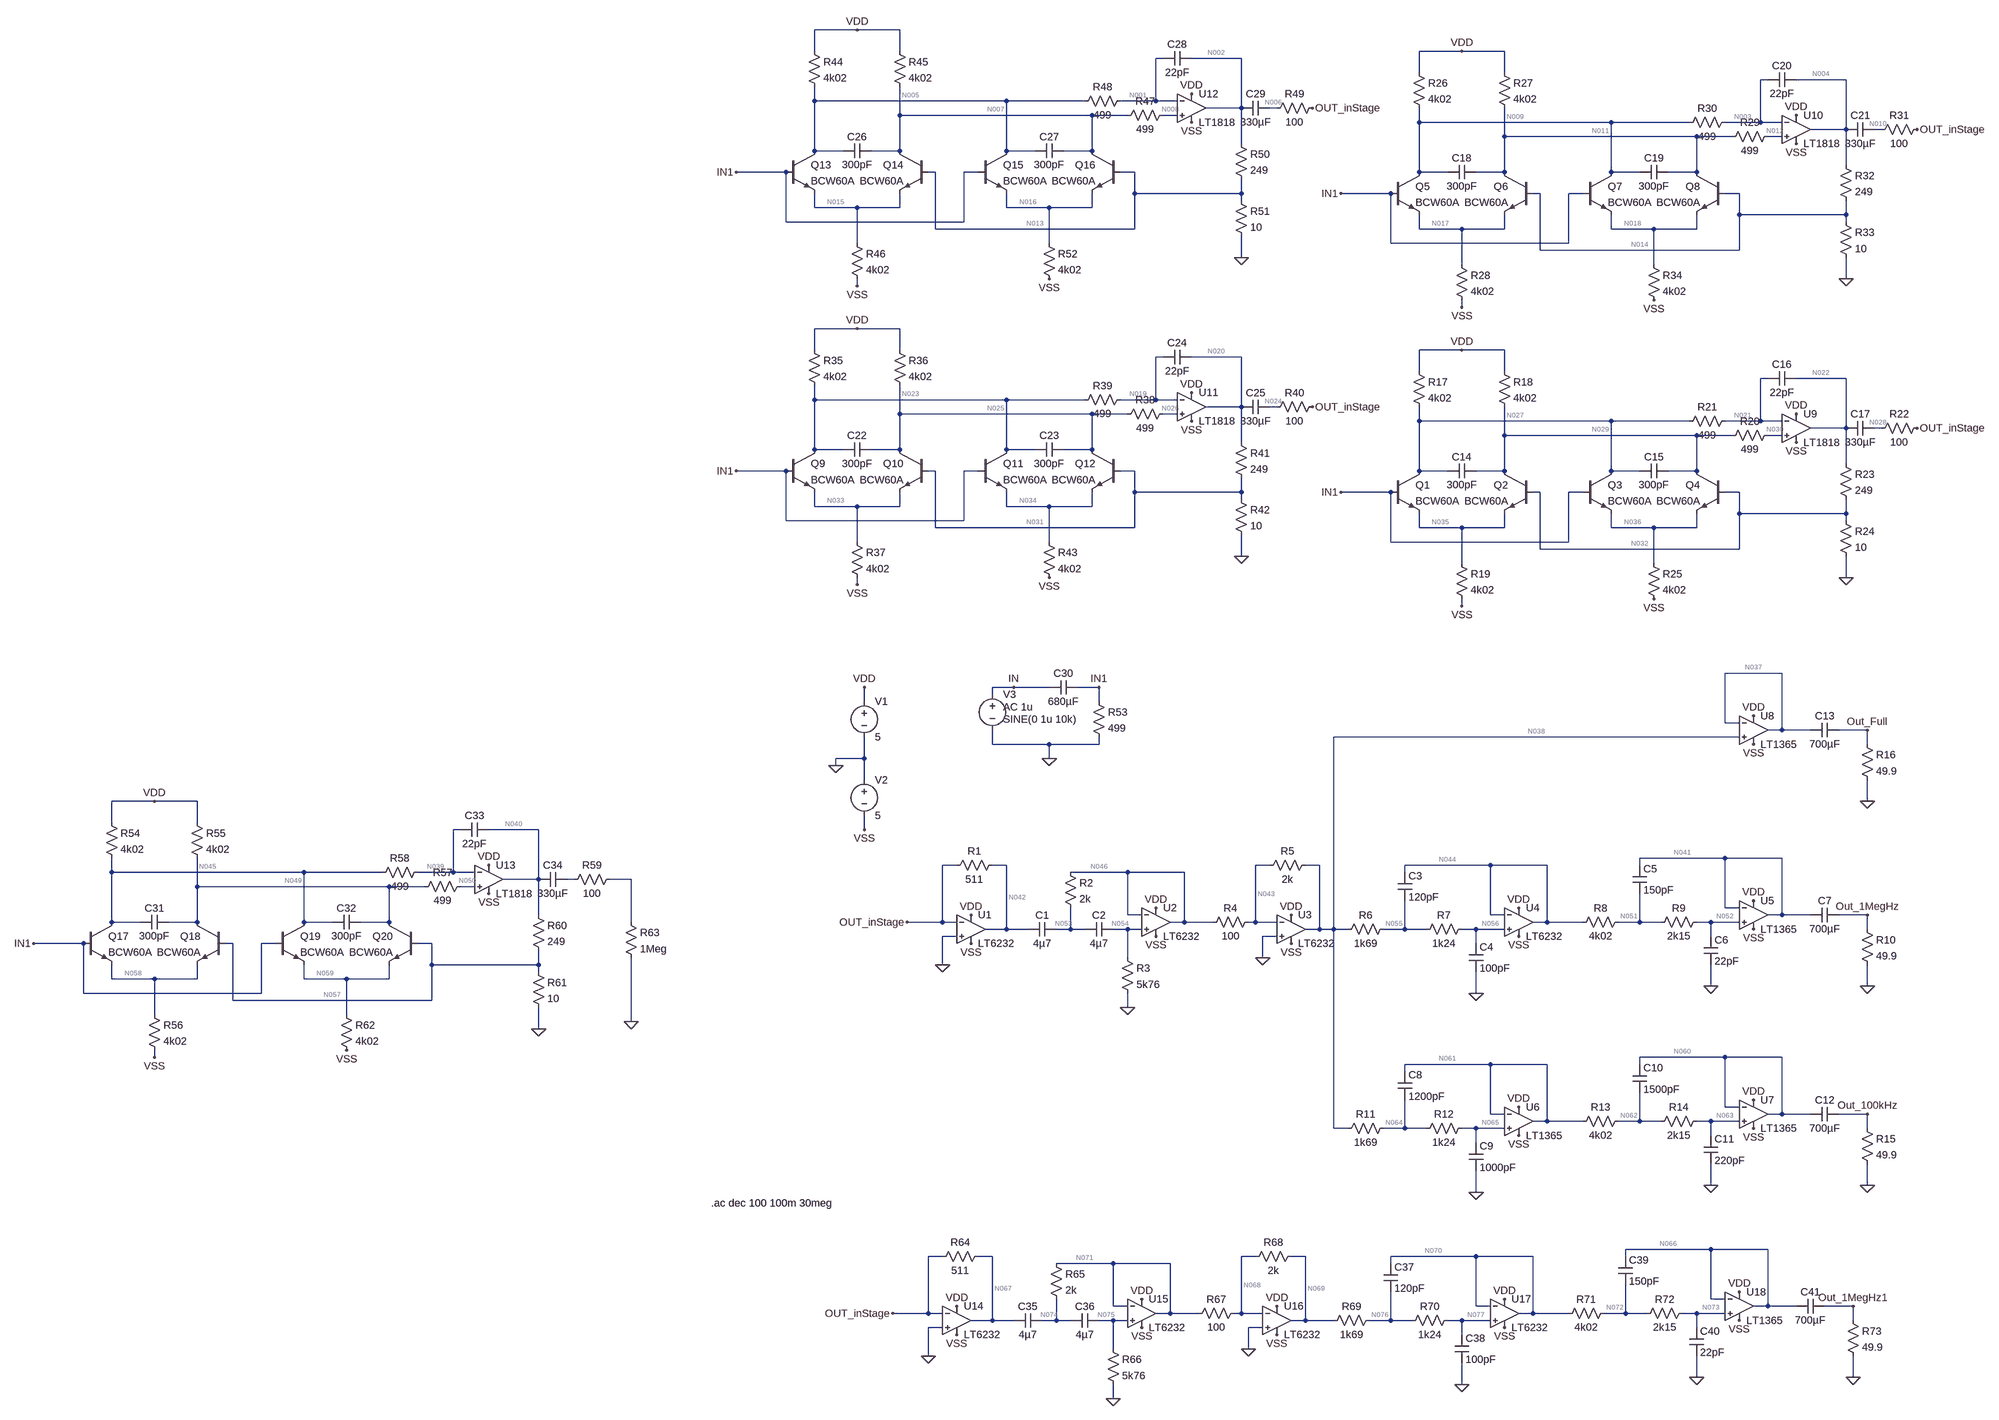
[diagram p0: schematic LNA_1MHz.asc]
LNA_1MHz.asc, the LTspice schematic file:
Version 4
SHEET 1 2840 1804
WIRE -64 -1680 -160 -1680
WIRE 32 -1680 -64 -1680
WIRE -160 -1632 -160 -1680
WIRE 32 -1632 32 -1680
WIRE 1296 -1632 1200 -1632
WIRE 1392 -1632 1296 -1632
WIRE 624 -1616 608 -1616
WIRE 800 -1616 688 -1616
WIRE 1200 -1584 1200 -1632
WIRE 1392 -1584 1392 -1632
WIRE 1984 -1568 1968 -1568
WIRE 2160 -1568 2048 -1568
WIRE -160 -1520 -160 -1552
WIRE 272 -1520 -160 -1520
WIRE 448 -1520 272 -1520
WIRE 608 -1520 608 -1616
WIRE 608 -1520 528 -1520
WIRE 656 -1520 608 -1520
WIRE 800 -1504 800 -1616
WIRE 800 -1504 720 -1504
WIRE 880 -1504 864 -1504
WIRE 32 -1488 32 -1552
WIRE 464 -1488 32 -1488
WIRE 544 -1488 464 -1488
WIRE 656 -1488 624 -1488
WIRE 1200 -1472 1200 -1504
WIRE 1632 -1472 1200 -1472
WIRE 1808 -1472 1632 -1472
WIRE 1968 -1472 1968 -1568
WIRE 1968 -1472 1888 -1472
WIRE 2016 -1472 1968 -1472
WIRE 2160 -1456 2160 -1568
WIRE 2160 -1456 2080 -1456
WIRE 2240 -1456 2224 -1456
WIRE 1392 -1440 1392 -1504
WIRE 1824 -1440 1392 -1440
WIRE 1904 -1440 1824 -1440
WIRE 2016 -1440 1984 -1440
WIRE 800 -1424 800 -1504
WIRE -160 -1408 -160 -1520
WIRE -96 -1408 -160 -1408
WIRE 32 -1408 32 -1488
WIRE 32 -1408 -32 -1408
WIRE 272 -1408 272 -1520
WIRE 336 -1408 272 -1408
WIRE 464 -1408 464 -1488
WIRE 464 -1408 400 -1408
WIRE 2160 -1376 2160 -1456
WIRE -224 -1360 -336 -1360
WIRE 112 -1360 96 -1360
WIRE 208 -1360 176 -1360
WIRE 560 -1360 528 -1360
WIRE 1200 -1360 1200 -1472
WIRE 1264 -1360 1200 -1360
WIRE 1392 -1360 1392 -1440
WIRE 1392 -1360 1328 -1360
WIRE 1632 -1360 1632 -1472
WIRE 1696 -1360 1632 -1360
WIRE 1824 -1360 1824 -1440
WIRE 1824 -1360 1760 -1360
WIRE 560 -1312 560 -1360
WIRE 800 -1312 800 -1344
WIRE 800 -1312 560 -1312
WIRE 1136 -1312 1024 -1312
WIRE 1472 -1312 1456 -1312
WIRE 1568 -1312 1536 -1312
WIRE 1920 -1312 1888 -1312
WIRE 800 -1296 800 -1312
WIRE -160 -1280 -160 -1312
WIRE -64 -1280 -160 -1280
WIRE 32 -1280 32 -1312
WIRE 32 -1280 -64 -1280
WIRE 272 -1280 272 -1312
WIRE 368 -1280 272 -1280
WIRE 464 -1280 464 -1312
WIRE 464 -1280 368 -1280
WIRE 1920 -1264 1920 -1312
WIRE 2160 -1264 2160 -1296
WIRE 2160 -1264 1920 -1264
WIRE -224 -1248 -224 -1360
WIRE 176 -1248 176 -1360
WIRE 176 -1248 -224 -1248
WIRE 2160 -1248 2160 -1264
WIRE 112 -1232 112 -1360
WIRE 560 -1232 560 -1312
WIRE 560 -1232 112 -1232
WIRE 1200 -1232 1200 -1264
WIRE 1296 -1232 1200 -1232
WIRE 1392 -1232 1392 -1264
WIRE 1392 -1232 1296 -1232
WIRE 1632 -1232 1632 -1264
WIRE 1728 -1232 1632 -1232
WIRE 1824 -1232 1824 -1264
WIRE 1824 -1232 1728 -1232
WIRE -64 -1200 -64 -1280
WIRE 368 -1200 368 -1280
WIRE 1136 -1200 1136 -1312
WIRE 1536 -1200 1536 -1312
WIRE 1536 -1200 1136 -1200
WIRE 1472 -1184 1472 -1312
WIRE 1920 -1184 1920 -1264
WIRE 1920 -1184 1472 -1184
WIRE 800 -1168 800 -1216
WIRE 1296 -1152 1296 -1232
WIRE 1728 -1152 1728 -1232
WIRE 2160 -1120 2160 -1168
WIRE -64 -1104 -64 -1120
WIRE 1296 -1056 1296 -1072
WIRE -64 -1008 -160 -1008
WIRE 32 -1008 -64 -1008
WIRE -160 -960 -160 -1008
WIRE 32 -960 32 -1008
WIRE 1296 -960 1200 -960
WIRE 1392 -960 1296 -960
WIRE 624 -944 608 -944
WIRE 800 -944 688 -944
WIRE 1200 -912 1200 -960
WIRE 1392 -912 1392 -960
WIRE 1984 -896 1968 -896
WIRE 2160 -896 2048 -896
WIRE -160 -848 -160 -880
WIRE 272 -848 -160 -848
WIRE 448 -848 272 -848
WIRE 608 -848 608 -944
WIRE 608 -848 528 -848
WIRE 656 -848 608 -848
WIRE 800 -832 800 -944
WIRE 800 -832 720 -832
WIRE 880 -832 864 -832
WIRE 32 -816 32 -880
WIRE 464 -816 32 -816
WIRE 544 -816 464 -816
WIRE 656 -816 624 -816
WIRE 1200 -800 1200 -832
WIRE 1632 -800 1200 -800
WIRE 1808 -800 1632 -800
WIRE 1968 -800 1968 -896
WIRE 1968 -800 1888 -800
WIRE 2016 -800 1968 -800
WIRE 2160 -784 2160 -896
WIRE 2160 -784 2080 -784
WIRE 2240 -784 2224 -784
WIRE 1392 -768 1392 -832
WIRE 1824 -768 1392 -768
WIRE 1904 -768 1824 -768
WIRE 2016 -768 1984 -768
WIRE 800 -752 800 -832
WIRE -160 -736 -160 -848
WIRE -96 -736 -160 -736
WIRE 32 -736 32 -816
WIRE 32 -736 -32 -736
WIRE 272 -736 272 -848
WIRE 336 -736 272 -736
WIRE 464 -736 464 -816
WIRE 464 -736 400 -736
WIRE 2160 -704 2160 -784
WIRE -224 -688 -336 -688
WIRE 112 -688 96 -688
WIRE 208 -688 176 -688
WIRE 560 -688 528 -688
WIRE 1200 -688 1200 -800
WIRE 1264 -688 1200 -688
WIRE 1392 -688 1392 -768
WIRE 1392 -688 1328 -688
WIRE 1632 -688 1632 -800
WIRE 1696 -688 1632 -688
WIRE 1824 -688 1824 -768
WIRE 1824 -688 1760 -688
WIRE 560 -640 560 -688
WIRE 800 -640 800 -672
WIRE 800 -640 560 -640
WIRE 1136 -640 1024 -640
WIRE 1472 -640 1456 -640
WIRE 1568 -640 1536 -640
WIRE 1920 -640 1888 -640
WIRE 800 -624 800 -640
WIRE -160 -608 -160 -640
WIRE -64 -608 -160 -608
WIRE 32 -608 32 -640
WIRE 32 -608 -64 -608
WIRE 272 -608 272 -640
WIRE 368 -608 272 -608
WIRE 464 -608 464 -640
WIRE 464 -608 368 -608
WIRE 1920 -592 1920 -640
WIRE 2160 -592 2160 -624
WIRE 2160 -592 1920 -592
WIRE -224 -576 -224 -688
WIRE 176 -576 176 -688
WIRE 176 -576 -224 -576
WIRE 2160 -576 2160 -592
WIRE 112 -560 112 -688
WIRE 560 -560 560 -640
WIRE 560 -560 112 -560
WIRE 1200 -560 1200 -592
WIRE 1296 -560 1200 -560
WIRE 1392 -560 1392 -592
WIRE 1392 -560 1296 -560
WIRE 1632 -560 1632 -592
WIRE 1728 -560 1632 -560
WIRE 1824 -560 1824 -592
WIRE 1824 -560 1728 -560
WIRE -64 -528 -64 -608
WIRE 368 -528 368 -608
WIRE 1136 -528 1136 -640
WIRE 1536 -528 1536 -640
WIRE 1536 -528 1136 -528
WIRE 1472 -512 1472 -640
WIRE 1920 -512 1920 -592
WIRE 1920 -512 1472 -512
WIRE 800 -496 800 -544
WIRE 1296 -480 1296 -560
WIRE 1728 -480 1728 -560
WIRE 2160 -448 2160 -496
WIRE -64 -432 -64 -448
WIRE 1296 -384 1296 -400
WIRE 2016 -208 1888 -208
WIRE 288 -176 240 -176
WIRE 368 -176 288 -176
WIRE 480 -176 432 -176
WIRE 240 -160 240 -176
WIRE -48 -144 -48 -176
WIRE 480 -144 480 -176
WIRE 1888 -96 1888 -208
WIRE 1920 -96 1888 -96
WIRE 2016 -80 2016 -208
WIRE 2016 -80 1984 -80
WIRE 2080 -80 2016 -80
WIRE 2208 -80 2144 -80
WIRE 1920 -64 1008 -64
WIRE 240 -48 240 -80
WIRE 368 -48 240 -48
WIRE 480 -48 480 -64
WIRE 480 -48 368 -48
WIRE 2208 -48 2208 -80
WIRE -48 -16 -48 -64
WIRE -48 -16 -112 -16
WIRE 368 -16 368 -48
WIRE -112 0 -112 -16
WIRE -48 32 -48 -16
WIRE -1696 80 -1792 80
WIRE -1600 80 -1696 80
WIRE 2208 80 2208 32
WIRE -1792 128 -1792 80
WIRE -1600 128 -1600 80
WIRE -1008 144 -1024 144
WIRE -832 144 -944 144
WIRE -48 144 -48 112
WIRE 1888 208 1696 208
WIRE 2016 208 1888 208
WIRE 160 224 128 224
WIRE 272 224 240 224
WIRE 864 224 832 224
WIRE 976 224 944 224
WIRE 1360 224 1168 224
WIRE 1488 224 1360 224
WIRE 1696 224 1696 208
WIRE -1792 240 -1792 208
WIRE -1360 240 -1792 240
WIRE -1184 240 -1360 240
WIRE -1024 240 -1024 144
WIRE -1024 240 -1104 240
WIRE -976 240 -1024 240
WIRE 544 240 416 240
WIRE 672 240 544 240
WIRE 1168 240 1168 224
WIRE -832 256 -832 144
WIRE -832 256 -912 256
WIRE -752 256 -768 256
WIRE -624 256 -672 256
WIRE -1600 272 -1600 208
WIRE -1168 272 -1600 272
WIRE -1088 272 -1168 272
WIRE -976 272 -1008 272
WIRE 1888 320 1888 208
WIRE 1920 320 1888 320
WIRE -832 336 -832 256
WIRE 544 336 544 240
WIRE 576 336 544 336
WIRE 1360 336 1360 224
WIRE 1392 336 1360 336
WIRE 2016 336 2016 208
WIRE 2016 336 1984 336
WIRE 2080 336 2016 336
WIRE 2208 336 2144 336
WIRE -1792 352 -1792 240
WIRE -1728 352 -1792 352
WIRE -1600 352 -1600 272
WIRE -1600 352 -1664 352
WIRE -1360 352 -1360 240
WIRE -1296 352 -1360 352
WIRE -1168 352 -1168 272
WIRE -1168 352 -1232 352
WIRE -624 352 -624 256
WIRE 128 352 128 224
WIRE 128 352 48 352
WIRE 160 352 128 352
WIRE 672 352 672 240
WIRE 672 352 640 352
WIRE 736 352 672 352
WIRE 832 352 832 224
WIRE 832 352 816 352
WIRE 880 352 832 352
WIRE 1488 352 1488 224
WIRE 1488 352 1456 352
WIRE 1568 352 1488 352
WIRE 1696 352 1696 288
WIRE 1696 352 1648 352
WIRE 1744 352 1696 352
WIRE 1856 352 1824 352
WIRE 1920 352 1856 352
WIRE 272 368 272 224
WIRE 272 368 224 368
WIRE 320 368 272 368
WIRE 416 368 416 320
WIRE 416 368 384 368
WIRE 448 368 416 368
WIRE 544 368 512 368
WIRE 576 368 544 368
WIRE 976 368 976 224
WIRE 976 368 944 368
WIRE 1008 368 1008 -64
WIRE 1008 368 976 368
WIRE 1040 368 1008 368
WIRE 1168 368 1168 304
WIRE 1168 368 1120 368
WIRE 1216 368 1168 368
WIRE 1328 368 1296 368
WIRE 1392 368 1328 368
WIRE 2208 368 2208 336
WIRE 160 384 128 384
WIRE 880 384 848 384
WIRE 1856 384 1856 352
WIRE -1856 400 -1968 400
WIRE -1520 400 -1536 400
WIRE -1424 400 -1456 400
WIRE -1072 400 -1104 400
WIRE 1328 400 1328 368
WIRE 544 432 544 368
WIRE 848 432 848 384
WIRE -1072 448 -1072 400
WIRE -832 448 -832 416
WIRE -832 448 -1072 448
WIRE 128 448 128 384
WIRE -832 464 -832 448
WIRE -1792 480 -1792 448
WIRE -1696 480 -1792 480
WIRE -1600 480 -1600 448
WIRE -1600 480 -1696 480
WIRE -1360 480 -1360 448
WIRE -1264 480 -1360 480
WIRE -1168 480 -1168 448
WIRE -1168 480 -1264 480
WIRE 1856 496 1856 448
WIRE 2208 496 2208 448
WIRE -1856 512 -1856 400
WIRE -1456 512 -1456 400
WIRE -1456 512 -1856 512
WIRE 1328 512 1328 464
WIRE -1520 528 -1520 400
WIRE -1072 528 -1072 448
WIRE -1072 528 -1520 528
WIRE 544 544 544 512
WIRE -1696 560 -1696 480
WIRE -1264 560 -1264 480
WIRE -624 576 -624 432
WIRE -832 592 -832 544
WIRE -1696 656 -1696 640
WIRE 1888 656 1696 656
WIRE 2016 656 1888 656
WIRE 1360 672 1168 672
WIRE 1488 672 1360 672
WIRE 1696 672 1696 656
WIRE 1168 688 1168 672
WIRE 1888 768 1888 656
WIRE 1920 768 1888 768
WIRE 1360 784 1360 672
WIRE 1392 784 1360 784
WIRE 2016 784 2016 656
WIRE 2016 784 1984 784
WIRE 2080 784 2016 784
WIRE 2208 784 2144 784
WIRE 1488 800 1488 672
WIRE 1488 800 1456 800
WIRE 1568 800 1488 800
WIRE 1696 800 1696 736
WIRE 1696 800 1648 800
WIRE 1744 800 1696 800
WIRE 1856 800 1824 800
WIRE 1920 800 1856 800
WIRE 1008 816 1008 368
WIRE 1040 816 1008 816
WIRE 1168 816 1168 752
WIRE 1168 816 1120 816
WIRE 1216 816 1168 816
WIRE 1328 816 1296 816
WIRE 1392 816 1328 816
WIRE 2208 816 2208 784
WIRE 1856 832 1856 800
WIRE 1328 848 1328 816
WIRE 1856 944 1856 896
WIRE 2208 944 2208 896
WIRE 1328 960 1328 912
WIRE 1856 1088 1664 1088
WIRE 1984 1088 1856 1088
WIRE 128 1104 96 1104
WIRE 240 1104 208 1104
WIRE 832 1104 800 1104
WIRE 944 1104 912 1104
WIRE 1328 1104 1136 1104
WIRE 1456 1104 1328 1104
WIRE 1664 1104 1664 1088
WIRE 512 1120 384 1120
WIRE 640 1120 512 1120
WIRE 1136 1120 1136 1104
WIRE 1856 1200 1856 1088
WIRE 1888 1200 1856 1200
WIRE 512 1216 512 1120
WIRE 544 1216 512 1216
WIRE 1328 1216 1328 1104
WIRE 1360 1216 1328 1216
WIRE 1984 1216 1984 1088
WIRE 1984 1216 1952 1216
WIRE 2048 1216 1984 1216
WIRE 2176 1216 2112 1216
WIRE 96 1232 96 1104
WIRE 96 1232 16 1232
WIRE 128 1232 96 1232
WIRE 640 1232 640 1120
WIRE 640 1232 608 1232
WIRE 704 1232 640 1232
WIRE 800 1232 800 1104
WIRE 800 1232 784 1232
WIRE 848 1232 800 1232
WIRE 1456 1232 1456 1104
WIRE 1456 1232 1424 1232
WIRE 1536 1232 1456 1232
WIRE 1664 1232 1664 1168
WIRE 1664 1232 1616 1232
WIRE 1712 1232 1664 1232
WIRE 1824 1232 1792 1232
WIRE 1888 1232 1824 1232
WIRE 240 1248 240 1104
WIRE 240 1248 192 1248
WIRE 288 1248 240 1248
WIRE 384 1248 384 1200
WIRE 384 1248 352 1248
WIRE 416 1248 384 1248
WIRE 512 1248 480 1248
WIRE 544 1248 512 1248
WIRE 944 1248 944 1104
WIRE 944 1248 912 1248
WIRE 1008 1248 944 1248
WIRE 1136 1248 1136 1184
WIRE 1136 1248 1088 1248
WIRE 1184 1248 1136 1248
WIRE 1296 1248 1264 1248
WIRE 1360 1248 1296 1248
WIRE 2176 1248 2176 1216
WIRE 128 1264 96 1264
WIRE 848 1264 816 1264
WIRE 1824 1264 1824 1232
WIRE 1296 1280 1296 1248
WIRE 512 1312 512 1248
WIRE 816 1312 816 1264
WIRE 96 1328 96 1264
WIRE 1824 1376 1824 1328
WIRE 2176 1376 2176 1328
WIRE 1296 1392 1296 1344
WIRE 512 1424 512 1392
FLAG -112 0 0
FLAG -48 -176 VDD
FLAG -48 144 VSS
FLAG 192 336 VDD
FLAG 192 400 VSS
FLAG 128 448 0
FLAG 544 544 0
FLAG 608 320 VDD
FLAG 608 384 VSS
FLAG 848 432 0
FLAG 912 400 VSS
FLAG 912 336 VDD
FLAG 1328 512 0
FLAG 1424 320 VDD
FLAG 1424 384 VSS
FLAG 1856 496 0
FLAG 1952 304 VDD
FLAG 1952 368 VSS
FLAG 2208 496 0
FLAG 2208 336 Out_1MegHz
FLAG 1328 960 0
FLAG 1424 768 VDD
FLAG 1424 832 VSS
FLAG 1856 944 0
FLAG 1952 752 VDD
FLAG 1952 816 VSS
FLAG 2208 944 0
FLAG 2208 784 Out_100kHz
FLAG 1952 -112 VDD
FLAG 1952 -48 VSS
FLAG 2208 80 0
FLAG 2208 -80 Out_Full
FLAG 1296 -384 VSS
FLAG 1296 -960 VDD
FLAG 2048 -816 VDD
FLAG 2048 -752 VSS
FLAG 2160 -448 0
FLAG 1728 -400 VSS
FLAG 1024 -640 IN1
FLAG 2320 -784 OUT_inStage
FLAG 1296 -1056 VSS
FLAG 1296 -1632 VDD
FLAG 2048 -1488 VDD
FLAG 2048 -1424 VSS
FLAG 2160 -1120 0
FLAG 1728 -1072 VSS
FLAG 1024 -1312 IN1
FLAG 2320 -1456 OUT_inStage
FLAG -64 -432 VSS
FLAG -64 -1008 VDD
FLAG 688 -864 VDD
FLAG 688 -800 VSS
FLAG 800 -496 0
FLAG 368 -448 VSS
FLAG -336 -688 IN1
FLAG 960 -832 OUT_inStage
FLAG -64 -1104 VSS
FLAG -64 -1680 VDD
FLAG 688 -1536 VDD
FLAG 688 -1472 VSS
FLAG 800 -1168 0
FLAG 368 -1120 VSS
FLAG -336 -1360 IN1
FLAG 960 -1504 OUT_inStage
FLAG 368 -16 0
FLAG 480 -176 IN1
FLAG 288 -176 IN
FLAG 48 352 OUT_inStage
FLAG -1696 656 VSS
FLAG -1696 80 VDD
FLAG -944 224 VDD
FLAG -944 288 VSS
FLAG -832 592 0
FLAG -1264 640 VSS
FLAG -1968 400 IN1
FLAG -624 576 0
FLAG 160 1216 VDD
FLAG 160 1280 VSS
FLAG 96 1328 0
FLAG 512 1424 0
FLAG 576 1200 VDD
FLAG 576 1264 VSS
FLAG 816 1312 0
FLAG 880 1280 VSS
FLAG 880 1216 VDD
FLAG 1296 1392 0
FLAG 1392 1200 VDD
FLAG 1392 1264 VSS
FLAG 1824 1376 0
FLAG 1920 1184 VDD
FLAG 1920 1248 VSS
FLAG 2176 1376 0
FLAG 2176 1216 Out_1MegHz1
FLAG 16 1232 OUT_inStage
SYMBOL voltage -48 -160 R0
SYMATTR InstName V1
SYMATTR Value 5
SYMBOL voltage -48 16 R0
WINDOW 123 0 0 Left 0
WINDOW 39 0 0 Left 0
SYMATTR InstName V2
SYMATTR Value 5
SYMBOL Opamps\\LT6232 192 368 R0
SYMATTR InstName U1
SYMBOL Opamps\\LT6232 608 352 R0
SYMATTR InstName U2
SYMBOL Opamps\\LT6232 912 368 R0
SYMATTR InstName U3
SYMBOL Opamps\\LT6232 1424 352 R0
SYMATTR InstName U4
SYMBOL res 256 208 R90
WINDOW 0 0 56 VBottom 2
WINDOW 3 32 56 VTop 2
SYMATTR InstName R1
SYMATTR Value 511
SYMBOL cap 384 352 R90
WINDOW 0 0 32 VBottom 2
WINDOW 3 32 32 VTop 2
SYMATTR InstName C1
SYMATTR Value 4µ7
SYMBOL cap 512 352 R90
WINDOW 0 0 32 VBottom 2
WINDOW 3 32 32 VTop 2
SYMATTR InstName C2
SYMATTR Value 4µ7
SYMBOL res 400 224 R0
SYMATTR InstName R2
SYMATTR Value 2k
SYMBOL res 528 416 R0
SYMATTR InstName R3
SYMATTR Value 5k76
SYMBOL res 832 336 R90
WINDOW 0 0 56 VBottom 2
WINDOW 3 32 56 VTop 2
SYMATTR InstName R4
SYMATTR Value 100
SYMBOL res 960 208 R90
WINDOW 0 0 56 VBottom 2
WINDOW 3 32 56 VTop 2
SYMATTR InstName R5
SYMATTR Value 2k
SYMBOL res 1136 352 R90
WINDOW 0 0 56 VBottom 2
WINDOW 3 32 56 VTop 2
SYMATTR InstName R6
SYMATTR Value 1k69
SYMBOL res 1312 352 R90
WINDOW 0 0 56 VBottom 2
WINDOW 3 32 56 VTop 2
SYMATTR InstName R7
SYMATTR Value 1k24
SYMBOL cap 1152 240 R0
SYMATTR InstName C3
SYMATTR Value 120pF
SYMBOL cap 1312 400 R0
SYMATTR InstName C4
SYMATTR Value 100pF
SYMBOL res 1664 336 R90
WINDOW 0 0 56 VBottom 2
WINDOW 3 32 56 VTop 2
SYMATTR InstName R8
SYMATTR Value 4k02
SYMBOL res 1840 336 R90
WINDOW 0 0 56 VBottom 2
WINDOW 3 32 56 VTop 2
SYMATTR InstName R9
SYMATTR Value 2k15
SYMBOL cap 1680 224 R0
SYMATTR InstName C5
SYMATTR Value 150pF
SYMBOL cap 1840 384 R0
SYMATTR InstName C6
SYMATTR Value 22pF
SYMBOL Opamps\\LT1365 1952 272 R0
SYMATTR InstName U5
SYMBOL cap 2144 320 R90
WINDOW 0 0 32 VBottom 2
WINDOW 3 32 32 VTop 2
SYMATTR InstName C7
SYMATTR Value 700µF
SYMBOL res 2192 352 R0
SYMATTR InstName R10
SYMATTR Value 49.9
SYMBOL res 1136 800 R90
WINDOW 0 0 56 VBottom 2
WINDOW 3 32 56 VTop 2
SYMATTR InstName R11
SYMATTR Value 1k69
SYMBOL res 1312 800 R90
WINDOW 0 0 56 VBottom 2
WINDOW 3 32 56 VTop 2
SYMATTR InstName R12
SYMATTR Value 1k24
SYMBOL cap 1152 688 R0
SYMATTR InstName C8
SYMATTR Value 1200pF
SYMBOL cap 1312 848 R0
SYMATTR InstName C9
SYMATTR Value 1000pF
SYMBOL res 1664 784 R90
WINDOW 0 0 56 VBottom 2
WINDOW 3 32 56 VTop 2
SYMATTR InstName R13
SYMATTR Value 4k02
SYMBOL res 1840 784 R90
WINDOW 0 0 56 VBottom 2
WINDOW 3 32 56 VTop 2
SYMATTR InstName R14
SYMATTR Value 2k15
SYMBOL cap 1680 672 R0
SYMATTR InstName C10
SYMATTR Value 1500pF
SYMBOL cap 1840 832 R0
SYMATTR InstName C11
SYMATTR Value 220pF
SYMBOL Opamps\\LT1365 1952 720 R0
SYMATTR InstName U7
SYMBOL cap 2144 768 R90
WINDOW 0 0 32 VBottom 2
WINDOW 3 32 32 VTop 2
SYMATTR InstName C12
SYMATTR Value 700µF
SYMBOL res 2192 800 R0
SYMATTR InstName R15
SYMATTR Value 49.9
SYMBOL Opamps\\LT1365 1424 736 R0
SYMATTR InstName U6
SYMBOL Opamps\\LT1365 1952 -144 R0
SYMATTR InstName U8
SYMBOL cap 2144 -96 R90
WINDOW 0 0 32 VBottom 2
WINDOW 3 32 32 VTop 2
SYMATTR InstName C13
SYMATTR Value 700µF
SYMBOL res 2192 -64 R0
SYMATTR InstName R16
SYMATTR Value 49.9
SYMBOL npn 1136 -688 R0
SYMATTR InstName Q1
SYMATTR Value BCW60A
SYMBOL npn 1456 -688 M0
SYMATTR InstName Q2
SYMATTR Value BCW60A
SYMBOL cap 1328 -704 R90
WINDOW 0 0 32 VBottom 2
WINDOW 3 32 32 VTop 2
SYMATTR InstName C14
SYMATTR Value 300pF
SYMBOL res 1184 -928 R0
SYMATTR InstName R17
SYMATTR Value 4k02
SYMBOL res 1376 -928 R0
SYMATTR InstName R18
SYMATTR Value 4k02
SYMBOL res 1280 -496 R0
SYMATTR InstName R19
SYMATTR Value 4k02
SYMBOL npn 1568 -688 R0
SYMATTR InstName Q3
SYMATTR Value BCW60A
SYMBOL npn 1888 -688 M0
SYMATTR InstName Q4
SYMATTR Value BCW60A
SYMBOL cap 1760 -704 R90
WINDOW 0 0 32 VBottom 2
WINDOW 3 32 32 VTop 2
SYMATTR InstName C15
SYMATTR Value 300pF
SYMBOL Opamps\\LT1818 2048 -784 R0
SYMATTR InstName U9
SYMBOL res 2000 -784 R90
WINDOW 0 0 56 VBottom 2
WINDOW 3 32 56 VTop 2
SYMATTR InstName R20
SYMATTR Value 499
SYMBOL res 1904 -816 R90
WINDOW 0 0 56 VBottom 2
WINDOW 3 32 56 VTop 2
SYMATTR InstName R21
SYMATTR Value 499
SYMBOL cap 2048 -912 R90
WINDOW 0 0 32 VBottom 2
WINDOW 3 32 32 VTop 2
SYMATTR InstName C16
SYMATTR Value 22pF
SYMBOL cap 2224 -800 R90
WINDOW 0 0 32 VBottom 2
WINDOW 3 32 32 VTop 2
SYMATTR InstName C17
SYMATTR Value 330µF
SYMBOL res 2336 -800 R90
WINDOW 0 0 56 VBottom 2
WINDOW 3 32 56 VTop 2
SYMATTR InstName R22
SYMATTR Value 100
SYMBOL res 2144 -720 R0
SYMATTR InstName R23
SYMATTR Value 249
SYMBOL res 2144 -592 R0
SYMATTR InstName R24
SYMATTR Value 10
SYMBOL res 1712 -496 R0
SYMATTR InstName R25
SYMATTR Value 4k02
SYMBOL npn 1136 -1360 R0
SYMATTR InstName Q5
SYMATTR Value BCW60A
SYMBOL npn 1456 -1360 M0
SYMATTR InstName Q6
SYMATTR Value BCW60A
SYMBOL cap 1328 -1376 R90
WINDOW 0 0 32 VBottom 2
WINDOW 3 32 32 VTop 2
SYMATTR InstName C18
SYMATTR Value 300pF
SYMBOL res 1184 -1600 R0
SYMATTR InstName R26
SYMATTR Value 4k02
SYMBOL res 1376 -1600 R0
SYMATTR InstName R27
SYMATTR Value 4k02
SYMBOL res 1280 -1168 R0
SYMATTR InstName R28
SYMATTR Value 4k02
SYMBOL npn 1568 -1360 R0
SYMATTR InstName Q7
SYMATTR Value BCW60A
SYMBOL npn 1888 -1360 M0
SYMATTR InstName Q8
SYMATTR Value BCW60A
SYMBOL cap 1760 -1376 R90
WINDOW 0 0 32 VBottom 2
WINDOW 3 32 32 VTop 2
SYMATTR InstName C19
SYMATTR Value 300pF
SYMBOL Opamps\\LT1818 2048 -1456 R0
SYMATTR InstName U10
SYMBOL res 2000 -1456 R90
WINDOW 0 0 56 VBottom 2
WINDOW 3 32 56 VTop 2
SYMATTR InstName R29
SYMATTR Value 499
SYMBOL res 1904 -1488 R90
WINDOW 0 0 56 VBottom 2
WINDOW 3 32 56 VTop 2
SYMATTR InstName R30
SYMATTR Value 499
SYMBOL cap 2048 -1584 R90
WINDOW 0 0 32 VBottom 2
WINDOW 3 32 32 VTop 2
SYMATTR InstName C20
SYMATTR Value 22pF
SYMBOL cap 2224 -1472 R90
WINDOW 0 0 32 VBottom 2
WINDOW 3 32 32 VTop 2
SYMATTR InstName C21
SYMATTR Value 330µF
SYMBOL res 2336 -1472 R90
WINDOW 0 0 56 VBottom 2
WINDOW 3 32 56 VTop 2
SYMATTR InstName R31
SYMATTR Value 100
SYMBOL res 2144 -1392 R0
SYMATTR InstName R32
SYMATTR Value 249
SYMBOL res 2144 -1264 R0
SYMATTR InstName R33
SYMATTR Value 10
SYMBOL res 1712 -1168 R0
SYMATTR InstName R34
SYMATTR Value 4k02
SYMBOL npn -224 -736 R0
SYMATTR InstName Q9
SYMATTR Value BCW60A
SYMBOL npn 96 -736 M0
SYMATTR InstName Q10
SYMATTR Value BCW60A
SYMBOL cap -32 -752 R90
WINDOW 0 0 32 VBottom 2
WINDOW 3 32 32 VTop 2
SYMATTR InstName C22
SYMATTR Value 300pF
SYMBOL res -176 -976 R0
SYMATTR InstName R35
SYMATTR Value 4k02
SYMBOL res 16 -976 R0
SYMATTR InstName R36
SYMATTR Value 4k02
SYMBOL res -80 -544 R0
SYMATTR InstName R37
SYMATTR Value 4k02
SYMBOL npn 208 -736 R0
SYMATTR InstName Q11
SYMATTR Value BCW60A
SYMBOL npn 528 -736 M0
SYMATTR InstName Q12
SYMATTR Value BCW60A
SYMBOL cap 400 -752 R90
WINDOW 0 0 32 VBottom 2
WINDOW 3 32 32 VTop 2
SYMATTR InstName C23
SYMATTR Value 300pF
SYMBOL Opamps\\LT1818 688 -832 R0
SYMATTR InstName U11
SYMBOL res 640 -832 R90
WINDOW 0 0 56 VBottom 2
WINDOW 3 32 56 VTop 2
SYMATTR InstName R38
SYMATTR Value 499
SYMBOL res 544 -864 R90
WINDOW 0 0 56 VBottom 2
WINDOW 3 32 56 VTop 2
SYMATTR InstName R39
SYMATTR Value 499
SYMBOL cap 688 -960 R90
WINDOW 0 0 32 VBottom 2
WINDOW 3 32 32 VTop 2
SYMATTR InstName C24
SYMATTR Value 22pF
SYMBOL cap 864 -848 R90
WINDOW 0 0 32 VBottom 2
WINDOW 3 32 32 VTop 2
SYMATTR InstName C25
SYMATTR Value 330µF
SYMBOL res 976 -848 R90
WINDOW 0 0 56 VBottom 2
WINDOW 3 32 56 VTop 2
SYMATTR InstName R40
SYMATTR Value 100
SYMBOL res 784 -768 R0
SYMATTR InstName R41
SYMATTR Value 249
SYMBOL res 784 -640 R0
SYMATTR InstName R42
SYMATTR Value 10
SYMBOL res 352 -544 R0
SYMATTR InstName R43
SYMATTR Value 4k02
SYMBOL npn -224 -1408 R0
SYMATTR InstName Q13
SYMATTR Value BCW60A
SYMBOL npn 96 -1408 M0
SYMATTR InstName Q14
SYMATTR Value BCW60A
SYMBOL cap -32 -1424 R90
WINDOW 0 0 32 VBottom 2
WINDOW 3 32 32 VTop 2
SYMATTR InstName C26
SYMATTR Value 300pF
SYMBOL res -176 -1648 R0
SYMATTR InstName R44
SYMATTR Value 4k02
SYMBOL res 16 -1648 R0
SYMATTR InstName R45
SYMATTR Value 4k02
SYMBOL res -80 -1216 R0
SYMATTR InstName R46
SYMATTR Value 4k02
SYMBOL npn 208 -1408 R0
SYMATTR InstName Q15
SYMATTR Value BCW60A
SYMBOL npn 528 -1408 M0
SYMATTR InstName Q16
SYMATTR Value BCW60A
SYMBOL cap 400 -1424 R90
WINDOW 0 0 32 VBottom 2
WINDOW 3 32 32 VTop 2
SYMATTR InstName C27
SYMATTR Value 300pF
SYMBOL Opamps\\LT1818 688 -1504 R0
SYMATTR InstName U12
SYMBOL res 640 -1504 R90
WINDOW 0 0 56 VBottom 2
WINDOW 3 32 56 VTop 2
SYMATTR InstName R47
SYMATTR Value 499
SYMBOL res 544 -1536 R90
WINDOW 0 0 56 VBottom 2
WINDOW 3 32 56 VTop 2
SYMATTR InstName R48
SYMATTR Value 499
SYMBOL cap 688 -1632 R90
WINDOW 0 0 32 VBottom 2
WINDOW 3 32 32 VTop 2
SYMATTR InstName C28
SYMATTR Value 22pF
SYMBOL cap 864 -1520 R90
WINDOW 0 0 32 VBottom 2
WINDOW 3 32 32 VTop 2
SYMATTR InstName C29
SYMATTR Value 330µF
SYMBOL res 976 -1520 R90
WINDOW 0 0 56 VBottom 2
WINDOW 3 32 56 VTop 2
SYMATTR InstName R49
SYMATTR Value 100
SYMBOL res 784 -1440 R0
SYMATTR InstName R50
SYMATTR Value 249
SYMBOL res 784 -1312 R0
SYMATTR InstName R51
SYMATTR Value 10
SYMBOL res 352 -1216 R0
SYMATTR InstName R52
SYMATTR Value 4k02
SYMBOL voltage 240 -176 R0
WINDOW 123 24 44 Left 2
WINDOW 39 0 0 Left 0
WINDOW 3 24 72 Left 2
SYMATTR Value2 AC 1u
SYMATTR Value SINE(0 1u 10k)
SYMATTR InstName V3
SYMBOL cap 432 -192 R90
WINDOW 0 0 32 VBottom 2
WINDOW 3 32 32 VTop 2
SYMATTR InstName C30
SYMATTR Value 680µF
SYMBOL res 464 -160 R0
SYMATTR InstName R53
SYMATTR Value 499
SYMBOL npn -1856 352 R0
SYMATTR InstName Q17
SYMATTR Value BCW60A
SYMBOL npn -1536 352 M0
SYMATTR InstName Q18
SYMATTR Value BCW60A
SYMBOL cap -1664 336 R90
WINDOW 0 0 32 VBottom 2
WINDOW 3 32 32 VTop 2
SYMATTR InstName C31
SYMATTR Value 300pF
SYMBOL res -1808 112 R0
SYMATTR InstName R54
SYMATTR Value 4k02
SYMBOL res -1616 112 R0
SYMATTR InstName R55
SYMATTR Value 4k02
SYMBOL res -1712 544 R0
SYMATTR InstName R56
SYMATTR Value 4k02
SYMBOL npn -1424 352 R0
SYMATTR InstName Q19
SYMATTR Value BCW60A
SYMBOL npn -1104 352 M0
SYMATTR InstName Q20
SYMATTR Value BCW60A
SYMBOL cap -1232 336 R90
WINDOW 0 0 32 VBottom 2
WINDOW 3 32 32 VTop 2
SYMATTR InstName C32
SYMATTR Value 300pF
SYMBOL Opamps\\LT1818 -944 256 R0
SYMATTR InstName U13
SYMBOL res -992 256 R90
WINDOW 0 0 56 VBottom 2
WINDOW 3 32 56 VTop 2
SYMATTR InstName R57
SYMATTR Value 499
SYMBOL res -1088 224 R90
WINDOW 0 0 56 VBottom 2
WINDOW 3 32 56 VTop 2
SYMATTR InstName R58
SYMATTR Value 499
SYMBOL cap -944 128 R90
WINDOW 0 0 32 VBottom 2
WINDOW 3 32 32 VTop 2
SYMATTR InstName C33
SYMATTR Value 22pF
SYMBOL cap -768 240 R90
WINDOW 0 0 32 VBottom 2
WINDOW 3 32 32 VTop 2
SYMATTR InstName C34
SYMATTR Value 330µF
SYMBOL res -656 240 R90
WINDOW 0 0 56 VBottom 2
WINDOW 3 32 56 VTop 2
SYMATTR InstName R59
SYMATTR Value 100
SYMBOL res -848 320 R0
SYMATTR InstName R60
SYMATTR Value 249
SYMBOL res -848 448 R0
SYMATTR InstName R61
SYMATTR Value 10
SYMBOL res -1280 544 R0
SYMATTR InstName R62
SYMATTR Value 4k02
SYMBOL res -640 336 R0
SYMATTR InstName R63
SYMATTR Value 1Meg
SYMBOL Opamps\\LT6232 160 1248 R0
SYMATTR InstName U14
SYMBOL Opamps\\LT6232 576 1232 R0
SYMATTR InstName U15
SYMBOL Opamps\\LT6232 880 1248 R0
SYMATTR InstName U16
SYMBOL Opamps\\LT6232 1392 1232 R0
SYMATTR InstName U17
SYMBOL res 224 1088 R90
WINDOW 0 0 56 VBottom 2
WINDOW 3 32 56 VTop 2
SYMATTR InstName R64
SYMATTR Value 511
SYMBOL cap 352 1232 R90
WINDOW 0 0 32 VBottom 2
WINDOW 3 32 32 VTop 2
SYMATTR InstName C35
SYMATTR Value 4µ7
SYMBOL cap 480 1232 R90
WINDOW 0 0 32 VBottom 2
WINDOW 3 32 32 VTop 2
SYMATTR InstName C36
SYMATTR Value 4µ7
SYMBOL res 368 1104 R0
SYMATTR InstName R65
SYMATTR Value 2k
SYMBOL res 496 1296 R0
SYMATTR InstName R66
SYMATTR Value 5k76
SYMBOL res 800 1216 R90
WINDOW 0 0 56 VBottom 2
WINDOW 3 32 56 VTop 2
SYMATTR InstName R67
SYMATTR Value 100
SYMBOL res 928 1088 R90
WINDOW 0 0 56 VBottom 2
WINDOW 3 32 56 VTop 2
SYMATTR InstName R68
SYMATTR Value 2k
SYMBOL res 1104 1232 R90
WINDOW 0 0 56 VBottom 2
WINDOW 3 32 56 VTop 2
SYMATTR InstName R69
SYMATTR Value 1k69
SYMBOL res 1280 1232 R90
WINDOW 0 0 56 VBottom 2
WINDOW 3 32 56 VTop 2
SYMATTR InstName R70
SYMATTR Value 1k24
SYMBOL cap 1120 1120 R0
SYMATTR InstName C37
SYMATTR Value 120pF
SYMBOL cap 1280 1280 R0
SYMATTR InstName C38
SYMATTR Value 100pF
SYMBOL res 1632 1216 R90
WINDOW 0 0 56 VBottom 2
WINDOW 3 32 56 VTop 2
SYMATTR InstName R71
SYMATTR Value 4k02
SYMBOL res 1808 1216 R90
WINDOW 0 0 56 VBottom 2
WINDOW 3 32 56 VTop 2
SYMATTR InstName R72
SYMATTR Value 2k15
SYMBOL cap 1648 1104 R0
SYMATTR InstName C39
SYMATTR Value 150pF
SYMBOL cap 1808 1264 R0
SYMATTR InstName C40
SYMATTR Value 22pF
SYMBOL Opamps\\LT1365 1920 1152 R0
SYMATTR InstName U18
SYMBOL cap 2112 1200 R90
WINDOW 0 0 32 VBottom 2
WINDOW 3 32 32 VTop 2
SYMATTR InstName C41
SYMATTR Value 700µF
SYMBOL res 2160 1232 R0
SYMATTR InstName R73
SYMATTR Value 49.9
TEXT -392 984 Left 2 !.ac dec 100 100m 30meg

The netlist it stands for:
* LNA_1MHz.asc
V1 VDD 0 5
V2 0 VSS 5
* U1: LT6232 (symbol Opamps\LT6232 not available, pins judged from their places): In+=0 In-=OUT_inStage V+=VDD V-=VSS OUT=N042
* U2: LT6232 (symbol Opamps\LT6232 not available, pins judged from their places): In+=N054 In-=N046 V+=VDD V-=VSS OUT=N046
* U3: LT6232 (symbol Opamps\LT6232 not available, pins judged from their places): In+=0 In-=N043 V+=VDD V-=VSS OUT=N038
* U4: LT6232 (symbol Opamps\LT6232 not available, pins judged from their places): In+=N056 In-=N044 V+=VDD V-=VSS OUT=N044
R1 N042 OUT_inStage 511
C1 N053 N042 4µ7
C2 N054 N053 4µ7
R2 N046 N053 2k
R3 N054 0 5k76
R4 N043 N046 100
R5 N038 N043 2k
R6 N055 N038 1k69
R7 N056 N055 1k24
C3 N044 N055 120pF
C4 N056 0 100pF
R8 N051 N044 4k02
R9 N052 N051 2k15
C5 N041 N051 150pF
C6 N052 0 22pF
XU5 N052 N041 VDD VSS N041 LT1365  ; pins In+ In- V+ V- OUT
C7 Out_1MegHz N041 700µF
R10 Out_1MegHz 0 49.9
R11 N064 N038 1k69
R12 N065 N064 1k24
C8 N061 N064 1200pF
C9 N065 0 1000pF
R13 N062 N061 4k02
R14 N063 N062 2k15
C10 N060 N062 1500pF
C11 N063 0 220pF
XU7 N063 N060 VDD VSS N060 LT1365  ; pins In+ In- V+ V- OUT
C12 Out_100kHz N060 700µF
R15 Out_100kHz 0 49.9
XU6 N065 N061 VDD VSS N061 LT1365  ; pins In+ In- V+ V- OUT
XU8 N038 N037 VDD VSS N037 LT1365  ; pins In+ In- V+ V- OUT
C13 Out_Full N037 700µF
R16 Out_Full 0 49.9
Q1 N027 IN1 N035 0 BCW60A
Q2 N029 N032 N035 0 BCW60A
C14 N029 N027 300pF
R17 VDD N027 4k02
R18 VDD N029 4k02
R19 N035 VSS 4k02
Q3 N027 IN1 N036 0 BCW60A
Q4 N029 N032 N036 0 BCW60A
C15 N029 N027 300pF
XU9 N030 N021 N022 VDD VSS LT1818  ; pins In+ In- OUT V+ V-
R20 N030 N029 499
R21 N021 N027 499
C16 N022 N021 22pF
C17 N028 N022 330µF
R22 OUT_inStage N028 100
R23 N022 N032 249
R24 N032 0 10
R25 N036 VSS 4k02
Q5 N009 IN1 N017 0 BCW60A
Q6 N011 N014 N017 0 BCW60A
C18 N011 N009 300pF
R26 VDD N009 4k02
R27 VDD N011 4k02
R28 N017 VSS 4k02
Q7 N009 IN1 N018 0 BCW60A
Q8 N011 N014 N018 0 BCW60A
C19 N011 N009 300pF
XU10 N012 N003 N004 VDD VSS LT1818  ; pins In+ In- OUT V+ V-
R29 N012 N011 499
R30 N003 N009 499
C20 N004 N003 22pF
C21 N010 N004 330µF
R31 OUT_inStage N010 100
R32 N004 N014 249
R33 N014 0 10
R34 N018 VSS 4k02
Q9 N023 IN1 N033 0 BCW60A
Q10 N025 N031 N033 0 BCW60A
C22 N025 N023 300pF
R35 VDD N023 4k02
R36 VDD N025 4k02
R37 N033 VSS 4k02
Q11 N023 IN1 N034 0 BCW60A
Q12 N025 N031 N034 0 BCW60A
C23 N025 N023 300pF
XU11 N026 N019 N020 VDD VSS LT1818  ; pins In+ In- OUT V+ V-
R38 N026 N025 499
R39 N019 N023 499
C24 N020 N019 22pF
C25 N024 N020 330µF
R40 OUT_inStage N024 100
R41 N020 N031 249
R42 N031 0 10
R43 N034 VSS 4k02
Q13 N005 IN1 N015 0 BCW60A
Q14 N007 N013 N015 0 BCW60A
C26 N007 N005 300pF
R44 VDD N005 4k02
R45 VDD N007 4k02
R46 N015 VSS 4k02
Q15 N005 IN1 N016 0 BCW60A
Q16 N007 N013 N016 0 BCW60A
C27 N007 N005 300pF
XU12 N008 N001 N002 VDD VSS LT1818  ; pins In+ In- OUT V+ V-
R47 N008 N007 499
R48 N001 N005 499
C28 N002 N001 22pF
C29 N006 N002 330µF
R49 OUT_inStage N006 100
R50 N002 N013 249
R51 N013 0 10
R52 N016 VSS 4k02
V3 IN 0 SINE(0 1u 10k) AC 1u
C30 IN1 IN 680µF
R53 IN1 0 499
Q17 N045 IN1 N058 0 BCW60A
Q18 N049 N057 N058 0 BCW60A
C31 N049 N045 300pF
R54 VDD N045 4k02
R55 VDD N049 4k02
R56 N058 VSS 4k02
Q19 N045 IN1 N059 0 BCW60A
Q20 N049 N057 N059 0 BCW60A
C32 N049 N045 300pF
XU13 N050 N039 N040 VDD VSS LT1818  ; pins In+ In- OUT V+ V-
R57 N050 N049 499
R58 N039 N045 499
C33 N040 N039 22pF
C34 N047 N040 330µF
R59 N048 N047 100
R60 N040 N057 249
R61 N057 0 10
R62 N059 VSS 4k02
R63 N048 0 1Meg
* U14: LT6232 (symbol Opamps\LT6232 not available, pins judged from their places): In+=0 In-=OUT_inStage V+=VDD V-=VSS OUT=N067
* U15: LT6232 (symbol Opamps\LT6232 not available, pins judged from their places): In+=N075 In-=N071 V+=VDD V-=VSS OUT=N071
* U16: LT6232 (symbol Opamps\LT6232 not available, pins judged from their places): In+=0 In-=N068 V+=VDD V-=VSS OUT=N069
* U17: LT6232 (symbol Opamps\LT6232 not available, pins judged from their places): In+=N077 In-=N070 V+=VDD V-=VSS OUT=N070
R64 N067 OUT_inStage 511
C35 N074 N067 4µ7
C36 N075 N074 4µ7
R65 N071 N074 2k
R66 N075 0 5k76
R67 N068 N071 100
R68 N069 N068 2k
R69 N076 N069 1k69
R70 N077 N076 1k24
C37 N070 N076 120pF
C38 N077 0 100pF
R71 N072 N070 4k02
R72 N073 N072 2k15
C39 N066 N072 150pF
C40 N073 0 22pF
XU18 N073 N066 VDD VSS N066 LT1365  ; pins In+ In- V+ V- OUT
C41 Out_1MegHz1 N066 700µF
R73 Out_1MegHz1 0 49.9
.model NPN NPN
.model PNP PNP
.lib standard.bjt
.ac dec 100 100m 30meg
.lib LTC2.lib
.backanno
.end

* Results of the author's LTspice run, read from the files saved beside the schematic
* Operating Point, zero values left out:
*   V(vdd) = 5 V
*   V(vss) = -5 V
*   V(out_instage) = -180.2 nV
*   V(n042) = 2.555 mV
*   V(n046) = -28.79 mV
*   V(n054) = -28.79 mV
*   V(n043) = -2.778 µV
*   V(n038) = 585.8 mV
*   V(n044) = 571 mV
*   V(n056) = 571 mV
*   V(n053) = -28.79 mV
*   V(n055) = 577.3 mV
*   V(n051) = 568.6 mV
*   V(n052) = 567.3 mV
*   V(n041) = 567.2 mV
*   V(n064) = 584.7 mV
*   V(n065) = 584 mV
*   V(n061) = 583.9 mV
*   V(n062) = 581.5 mV
*   V(n063) = 580.1 mV
*   V(n060) = 580.1 mV
*   V(n037) = 585.7 mV
*   V(n027) = 687.4 mV
*   V(in1) = -22.2 mV
*   V(n035) = -643.7 mV
*   V(n029) = 687.2 mV
*   V(n032) = -22.2 mV
*   V(n036) = -643.7 mV
*   V(n021) = 688.4 mV
*   V(n030) = 688.1 mV
*   V(n022) = -572.8 mV
*   V(n028) = -180.2 nV
*   V(n009) = 687.4 mV
*   V(n017) = -643.7 mV
*   V(n011) = 687.2 mV
*   V(n014) = -22.2 mV
*   V(n018) = -643.7 mV
*   V(n003) = 688.4 mV
*   V(n012) = 688.1 mV
*   V(n004) = -572.8 mV
*   V(n010) = -180.2 nV
*   V(n023) = 687.4 mV
*   V(n033) = -643.7 mV
*   V(n025) = 687.2 mV
*   V(n031) = -22.2 mV
*   V(n034) = -643.7 mV
*   V(n019) = 688.4 mV
*   V(n026) = 688.1 mV
*   V(n020) = -572.8 mV
*   V(n024) = -180.2 nV
*   V(n005) = 687.4 mV
*   V(n015) = -643.7 mV
*   V(n007) = 687.2 mV
*   V(n013) = -22.2 mV
*   V(n016) = -643.7 mV
*   V(n001) = 688.4 mV
*   V(n008) = 688.1 mV
*   V(n002) = -572.8 mV
*   V(n006) = -180.2 nV
*   V(n045) = 687.4 mV
*   V(n058) = -643.7 mV
*   V(n049) = 687.2 mV
*   V(n057) = -22.2 mV
*   V(n059) = -643.7 mV
*   V(n039) = 688.4 mV
*   V(n050) = 688.1 mV
*   V(n040) = -572.8 mV
*   V(n067) = 2.555 mV
*   V(n071) = -28.79 mV
*   V(n075) = -28.79 mV
*   V(n068) = -2.767 µV
*   V(n069) = 585.8 mV
*   V(n070) = 571 mV
*   V(n077) = 571 mV
*   V(n074) = -28.79 mV
*   V(n076) = 577.3 mV
*   V(n072) = 568.6 mV
*   V(n073) = 567.3 mV
*   V(n066) = 567.2 mV
*   Ic(Q20) = 537.4 µA
*   Ib(Q20) = 4.45 µA
*   Ie(Q20) = -541.8 µA
*   Ic(Q19) = 537.4 µA
*   Ib(Q19) = 4.449 µA
*   Ie(Q19) = -541.8 µA
*   Ic(Q18) = 537.4 µA
*   Ib(Q18) = 4.45 µA
*   Ie(Q18) = -541.8 µA
*   Ic(Q17) = 537.4 µA
*   Ib(Q17) = 4.449 µA
*   Ie(Q17) = -541.8 µA
*   Ic(Q16) = 537.4 µA
*   Ib(Q16) = 4.45 µA
*   Ie(Q16) = -541.8 µA
*   Ic(Q15) = 537.4 µA
*   Ib(Q15) = 4.449 µA
*   Ie(Q15) = -541.8 µA
*   Ic(Q14) = 537.4 µA
*   Ib(Q14) = 4.45 µA
*   Ie(Q14) = -541.8 µA
*   Ic(Q13) = 537.4 µA
*   Ib(Q13) = 4.449 µA
*   Ie(Q13) = -541.8 µA
*   Ic(Q12) = 537.4 µA
*   Ib(Q12) = 4.45 µA
*   Ie(Q12) = -541.8 µA
*   Ic(Q11) = 537.4 µA
*   Ib(Q11) = 4.449 µA
*   Ie(Q11) = -541.8 µA
*   Ic(Q10) = 537.4 µA
*   Ib(Q10) = 4.45 µA
*   Ie(Q10) = -541.8 µA
*   Ic(Q9) = 537.4 µA
*   Ib(Q9) = 4.449 µA
*   Ie(Q9) = -541.8 µA
*   Ic(Q8) = 537.4 µA
*   Ib(Q8) = 4.45 µA
*   Ie(Q8) = -541.8 µA
*   Ic(Q7) = 537.4 µA
*   Ib(Q7) = 4.449 µA
*   Ie(Q7) = -541.8 µA
*   Ic(Q6) = 537.4 µA
*   Ib(Q6) = 4.45 µA
*   Ie(Q6) = -541.8 µA
*   Ic(Q5) = 537.4 µA
*   Ib(Q5) = 4.449 µA
*   Ie(Q5) = -541.8 µA
*   Ic(Q4) = 537.4 µA
*   Ib(Q4) = 4.45 µA
*   Ie(Q4) = -541.8 µA
*   Ic(Q3) = 537.4 µA
*   Ib(Q3) = 4.449 µA
*   Ie(Q3) = -541.8 µA
*   Ic(Q2) = 537.4 µA
*   Ib(Q2) = 4.45 µA
*   Ie(Q2) = -541.8 µA
*   Ic(Q1) = 537.4 µA
*   Ib(Q1) = 4.449 µA
*   Ie(Q1) = -541.8 µA
*   I(R72) = -612 nA
*   I(R71) = -612 nA
*   I(R70) = -5.029 µA
*   I(R69) = -5.029 µA
*   I(R68) = 292.9 µA
*   I(R67) = 287.9 µA
*   I(R66) = -4.999 µA
*   I(R64) = 5.001 µA
*   I(R62) = 1.084 mA
*   I(R61) = -2.22 mA
*   I(R60) = -2.211 mA
*   I(R58) = 1.93 µA
*   I(R57) = 1.931 µA
*   I(R56) = 1.084 mA
*   I(R55) = 1.073 mA
*   I(R54) = 1.073 mA
*   I(R53) = -44.49 µA
*   I(R52) = 1.084 mA
*   I(R51) = -2.22 mA
*   I(R50) = -2.211 mA
*   I(R48) = 1.93 µA
*   I(R47) = 1.931 µA
*   I(R46) = 1.084 mA
*   I(R45) = 1.073 mA
*   I(R44) = 1.073 mA
*   I(R43) = 1.084 mA
*   I(R42) = -2.22 mA
*   I(R41) = -2.211 mA
*   I(R39) = 1.93 µA
*   I(R38) = 1.931 µA
*   I(R37) = 1.084 mA
*   I(R36) = 1.073 mA
*   I(R35) = 1.073 mA
*   I(R34) = 1.084 mA
*   I(R33) = -2.22 mA
*   I(R32) = -2.211 mA
*   I(R30) = 1.93 µA
*   I(R29) = 1.931 µA
*   I(R28) = 1.084 mA
*   I(R27) = 1.073 mA
*   I(R26) = 1.073 mA
*   I(R25) = 1.084 mA
*   I(R24) = -2.22 mA
*   I(R23) = -2.211 mA
*   I(R21) = 1.93 µA
*   I(R20) = 1.931 µA
*   I(R19) = 1.084 mA
*   I(R18) = 1.073 mA
*   I(R17) = 1.073 mA
*   I(R14) = -612.2 nA
*   I(R13) = -612.2 nA
*   I(R12) = -612.3 nA
*   I(R11) = -612.3 nA
*   I(R9) = -612 nA
*   I(R8) = -612 nA
*   I(R7) = -5.029 µA
*   I(R6) = -5.029 µA
*   I(R5) = 292.9 µA
*   I(R4) = 287.9 µA
*   I(R3) = -4.999 µA
*   I(R1) = 5.001 µA
*   I(V2) = -114.5 mA
*   I(V1) = -103.3 mA